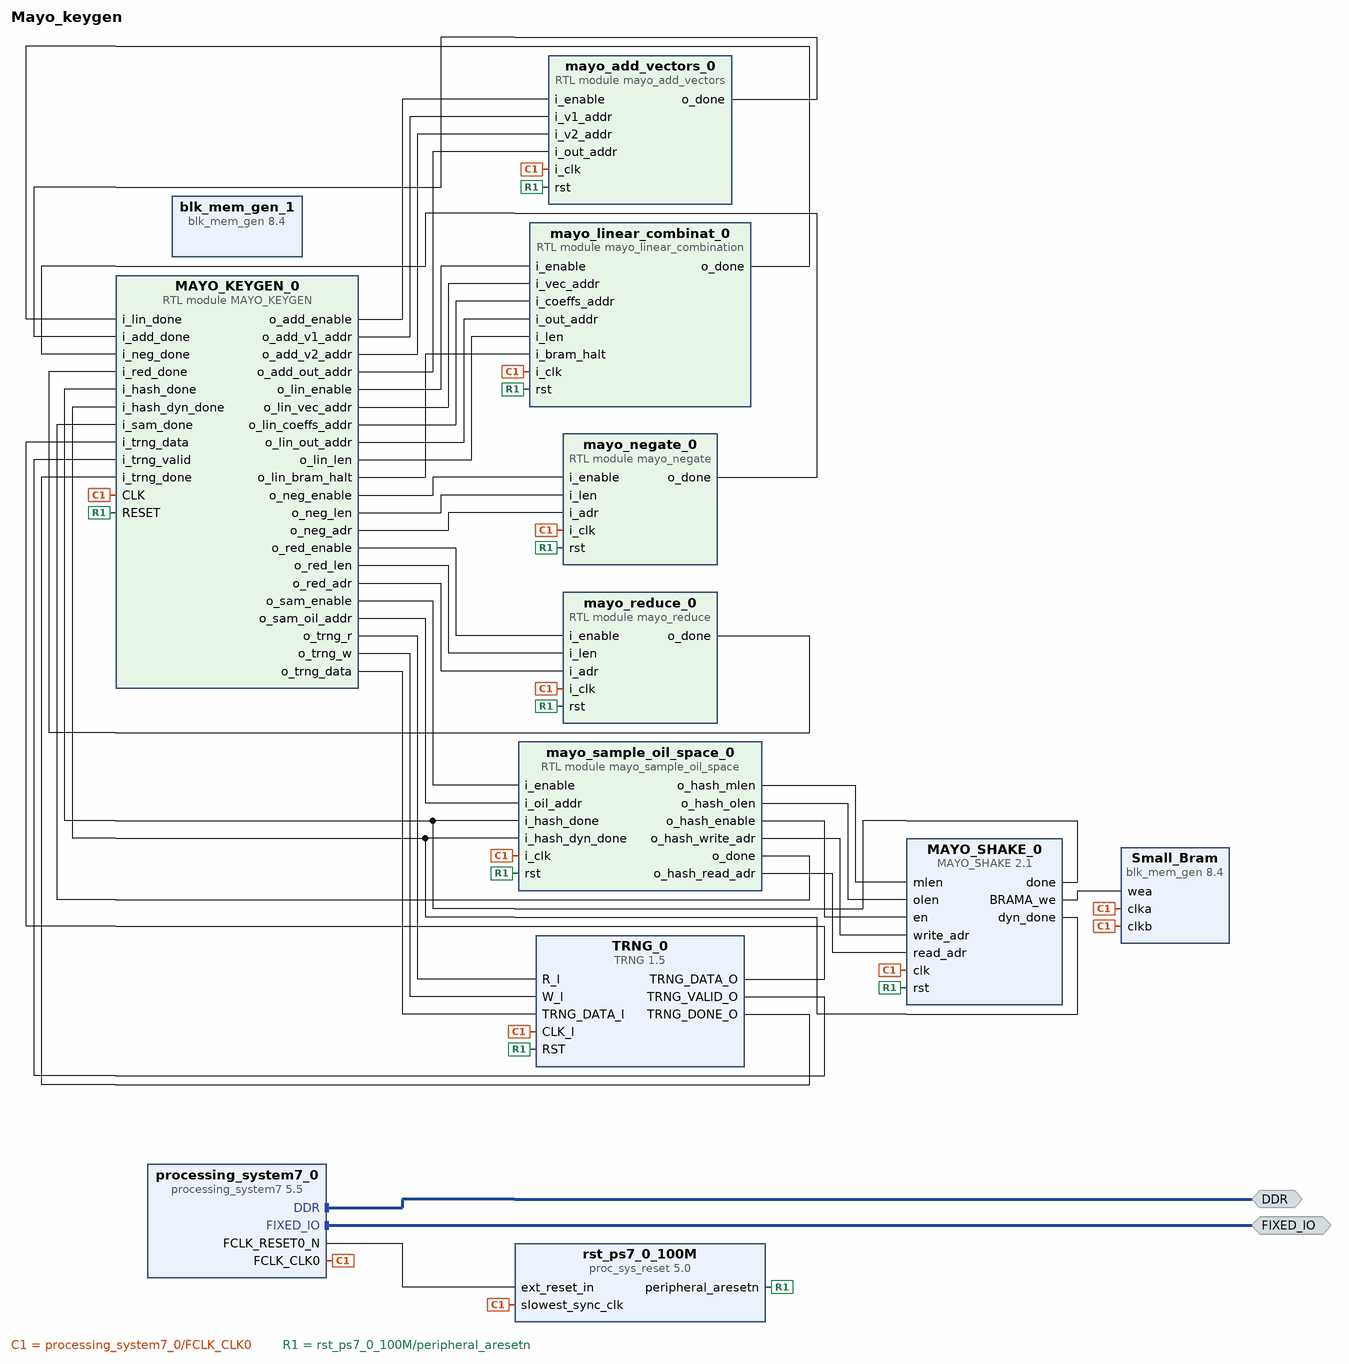
[diagram p0: block diagram of the top level]
# Vivado block design Mayo_keygen, xc7z020clg484-1, Vivado 2020.2
create_bd_design Mayo_keygen

create_bd_intf_port -mode Master -vlnv xilinx.com:interface:ddrx_rtl:1.0 DDR
create_bd_intf_port -mode Master -vlnv xilinx.com:display_processing_system7:fixedio_rtl:1.0 FIXED_IO

create_bd_cell -type ip -vlnv user.org:user:TRNG:1.5 TRNG_0
create_bd_cell -type ip -vlnv xilinx.com:ip:blk_mem_gen:8.4 Small_Bram
set_property -dict [list \
  CONFIG.Byte_Size 8 \
  CONFIG.Enable_32bit_Address false \
  CONFIG.Enable_B Use_ENB_Pin \
  CONFIG.Memory_Type True_Dual_Port_RAM \
  CONFIG.Port_B_Clock 100 \
  CONFIG.Port_B_Enable_Rate 100 \
  CONFIG.Port_B_Write_Rate 50 \
  CONFIG.Read_Width_A 32 \
  CONFIG.Read_Width_B 32 \
  CONFIG.Register_PortA_Output_of_Memory_Primitives false \
  CONFIG.Register_PortB_Output_of_Memory_Primitives false \
  CONFIG.Use_Byte_Write_Enable true \
  CONFIG.Use_RSTA_Pin false \
  CONFIG.Use_RSTB_Pin false \
  CONFIG.Write_Depth_A 16384 \
  CONFIG.Write_Width_A 32 \
  CONFIG.Write_Width_B 32 \
  CONFIG.use_bram_block Stand_Alone \
] [get_bd_cells Small_Bram]
create_bd_cell -type ip -vlnv xilinx.com:ip:blk_mem_gen:8.4 blk_mem_gen_1
set_property -dict [list \
  CONFIG.Enable_32bit_Address false \
  CONFIG.Enable_B Use_ENB_Pin \
  CONFIG.Memory_Type True_Dual_Port_RAM \
  CONFIG.Port_B_Clock 100 \
  CONFIG.Port_B_Enable_Rate 100 \
  CONFIG.Port_B_Write_Rate 50 \
  CONFIG.Register_PortA_Output_of_Memory_Primitives true \
  CONFIG.Register_PortB_Output_of_Memory_Primitives true \
  CONFIG.Use_Byte_Write_Enable false \
  CONFIG.Use_RSTA_Pin false \
  CONFIG.Use_RSTB_Pin false \
  CONFIG.use_bram_block Stand_Alone \
] [get_bd_cells blk_mem_gen_1]
create_bd_cell -type ip -vlnv user.org:user:MAYO_SHAKE:2.1 MAYO_SHAKE_0
create_bd_cell -type ip -vlnv xilinx.com:ip:processing_system7:5.5 processing_system7_0
set_property -dict [list \
  CONFIG.PCW_APU_PERIPHERAL_FREQMHZ 666.666667 \
  CONFIG.PCW_ENET0_ENET0_IO {MIO 16 .. 27} \
  CONFIG.PCW_ENET0_GRP_MDIO_ENABLE 1 \
  CONFIG.PCW_ENET0_GRP_MDIO_IO {MIO 52 .. 53} \
  CONFIG.PCW_ENET0_PERIPHERAL_ENABLE 1 \
  CONFIG.PCW_ENET0_RESET_ENABLE 0 \
  CONFIG.PCW_ENET_RESET_ENABLE 1 \
  CONFIG.PCW_ENET_RESET_SELECT {Share reset pin} \
  CONFIG.PCW_FPGA0_PERIPHERAL_FREQMHZ 100.000000 \
  CONFIG.PCW_FPGA1_PERIPHERAL_FREQMHZ 150.000000 \
  CONFIG.PCW_FPGA2_PERIPHERAL_FREQMHZ 50.000000 \
  CONFIG.PCW_GPIO_MIO_GPIO_ENABLE 1 \
  CONFIG.PCW_GPIO_MIO_GPIO_IO MIO \
  CONFIG.PCW_I2C_RESET_ENABLE 1 \
  CONFIG.PCW_PERIPHERAL_BOARD_PRESET part0 \
  CONFIG.PCW_PRESET_BANK1_VOLTAGE {LVCMOS 1.8V} \
  CONFIG.PCW_QSPI_GRP_SINGLE_SS_ENABLE 1 \
  CONFIG.PCW_QSPI_GRP_SINGLE_SS_IO {MIO 1 .. 6} \
  CONFIG.PCW_QSPI_PERIPHERAL_ENABLE 1 \
  CONFIG.PCW_QSPI_PERIPHERAL_FREQMHZ 200.000000 \
  CONFIG.PCW_QSPI_QSPI_IO {MIO 1 .. 6} \
  CONFIG.PCW_SD0_GRP_CD_ENABLE 1 \
  CONFIG.PCW_SD0_GRP_CD_IO {MIO 47} \
  CONFIG.PCW_SD0_GRP_WP_ENABLE 1 \
  CONFIG.PCW_SD0_GRP_WP_IO {MIO 46} \
  CONFIG.PCW_SD0_PERIPHERAL_ENABLE 1 \
  CONFIG.PCW_SD0_SD0_IO {MIO 40 .. 45} \
  CONFIG.PCW_SDIO_PERIPHERAL_FREQMHZ 50 \
  CONFIG.PCW_SINGLE_QSPI_DATA_MODE x4 \
  CONFIG.PCW_TTC0_PERIPHERAL_ENABLE 1 \
  CONFIG.PCW_TTC0_TTC0_IO EMIO \
  CONFIG.PCW_UART1_PERIPHERAL_ENABLE 1 \
  CONFIG.PCW_UART1_UART1_IO {MIO 48 .. 49} \
  CONFIG.PCW_UART_PERIPHERAL_FREQMHZ 50 \
  CONFIG.PCW_UIPARAM_DDR_FREQ_MHZ 533.333313 \
  CONFIG.PCW_UIPARAM_DDR_PARTNO {MT41J128M16 HA-15E} \
  CONFIG.PCW_USB0_PERIPHERAL_ENABLE 1 \
  CONFIG.PCW_USB0_RESET_ENABLE 0 \
  CONFIG.PCW_USB0_USB0_IO {MIO 28 .. 39} \
  CONFIG.PCW_USB_RESET_ENABLE 1 \
  CONFIG.PCW_USB_RESET_SELECT {Share reset pin} \
  CONFIG.preset ZedBoard \
] [get_bd_cells processing_system7_0]
# 500 more settings of processing_system7_0 are not shown: defaults, MIO pin electricals, DDR timing, and values the tool derives
create_bd_cell -type ip -vlnv xilinx.com:ip:proc_sys_reset:5.0 rst_ps7_0_100M
create_bd_cell -type module -reference MAYO_KEYGEN MAYO_KEYGEN_0
set_property -dict {CONFIG.BRAM_SIZE 13} [get_bd_cells MAYO_KEYGEN_0]
create_bd_cell -type module -reference mayo_add_vectors mayo_add_vectors_0
create_bd_cell -type module -reference mayo_linear_combination mayo_linear_combinat_0
create_bd_cell -type module -reference mayo_sample_oil_space mayo_sample_oil_space_0
create_bd_cell -type module -reference mayo_negate mayo_negate_0
create_bd_cell -type module -reference mayo_reduce mayo_reduce_0

# ---- connections ----

connect_bd_intf_net [get_bd_intf_ports DDR] [get_bd_intf_pins processing_system7_0/DDR]
connect_bd_intf_net [get_bd_intf_ports FIXED_IO] [get_bd_intf_pins processing_system7_0/FIXED_IO]
connect_bd_net [get_bd_pins processing_system7_0/FCLK_CLK0] \
  [get_bd_pins TRNG_0/CLK_I] [get_bd_pins Small_Bram/clka] [get_bd_pins Small_Bram/clkb] [get_bd_pins MAYO_SHAKE_0/clk] \
  [get_bd_pins rst_ps7_0_100M/slowest_sync_clk] [get_bd_pins MAYO_KEYGEN_0/CLK] [get_bd_pins mayo_add_vectors_0/i_clk] \
  [get_bd_pins mayo_linear_combinat_0/i_clk] [get_bd_pins mayo_sample_oil_space_0/i_clk] [get_bd_pins mayo_negate_0/i_clk] \
  [get_bd_pins mayo_reduce_0/i_clk]
connect_bd_net [get_bd_pins processing_system7_0/FCLK_RESET0_N] [get_bd_pins rst_ps7_0_100M/ext_reset_in]
connect_bd_net [get_bd_pins rst_ps7_0_100M/peripheral_aresetn] \
  [get_bd_pins TRNG_0/RST] [get_bd_pins MAYO_SHAKE_0/rst] [get_bd_pins MAYO_KEYGEN_0/RESET] \
  [get_bd_pins mayo_add_vectors_0/rst] [get_bd_pins mayo_linear_combinat_0/rst] [get_bd_pins mayo_sample_oil_space_0/rst] \
  [get_bd_pins mayo_negate_0/rst] [get_bd_pins mayo_reduce_0/rst]
connect_bd_net [get_bd_pins MAYO_KEYGEN_0/o_trng_r] [get_bd_pins TRNG_0/R_I]
connect_bd_net [get_bd_pins MAYO_KEYGEN_0/o_trng_w] [get_bd_pins TRNG_0/W_I]
connect_bd_net [get_bd_pins MAYO_KEYGEN_0/o_trng_data] [get_bd_pins TRNG_0/TRNG_DATA_I]
connect_bd_net [get_bd_pins TRNG_0/TRNG_DATA_O] [get_bd_pins MAYO_KEYGEN_0/i_trng_data]
connect_bd_net [get_bd_pins TRNG_0/TRNG_VALID_O] [get_bd_pins MAYO_KEYGEN_0/i_trng_valid]
connect_bd_net [get_bd_pins TRNG_0/TRNG_DONE_O] [get_bd_pins MAYO_KEYGEN_0/i_trng_done]
connect_bd_net [get_bd_pins MAYO_KEYGEN_0/o_red_enable] [get_bd_pins mayo_reduce_0/i_enable]
connect_bd_net [get_bd_pins MAYO_KEYGEN_0/o_red_len] [get_bd_pins mayo_reduce_0/i_len]
connect_bd_net [get_bd_pins MAYO_KEYGEN_0/o_red_adr] [get_bd_pins mayo_reduce_0/i_adr]
connect_bd_net [get_bd_pins mayo_reduce_0/o_done] [get_bd_pins MAYO_KEYGEN_0/i_red_done]
connect_bd_net [get_bd_pins MAYO_KEYGEN_0/o_lin_enable] [get_bd_pins mayo_linear_combinat_0/i_enable]
connect_bd_net [get_bd_pins MAYO_KEYGEN_0/o_lin_vec_addr] [get_bd_pins mayo_linear_combinat_0/i_vec_addr]
connect_bd_net [get_bd_pins MAYO_KEYGEN_0/o_lin_coeffs_addr] [get_bd_pins mayo_linear_combinat_0/i_coeffs_addr]
connect_bd_net [get_bd_pins MAYO_KEYGEN_0/o_lin_out_addr] [get_bd_pins mayo_linear_combinat_0/i_out_addr]
connect_bd_net [get_bd_pins MAYO_KEYGEN_0/o_lin_len] [get_bd_pins mayo_linear_combinat_0/i_len]
connect_bd_net [get_bd_pins mayo_linear_combinat_0/o_done] [get_bd_pins MAYO_KEYGEN_0/i_lin_done]
connect_bd_net [get_bd_pins MAYO_KEYGEN_0/o_add_enable] [get_bd_pins mayo_add_vectors_0/i_enable]
connect_bd_net [get_bd_pins MAYO_KEYGEN_0/o_add_v1_addr] [get_bd_pins mayo_add_vectors_0/i_v1_addr]
connect_bd_net [get_bd_pins MAYO_KEYGEN_0/o_add_v2_addr] [get_bd_pins mayo_add_vectors_0/i_v2_addr]
connect_bd_net [get_bd_pins MAYO_KEYGEN_0/o_add_out_addr] [get_bd_pins mayo_add_vectors_0/i_out_addr]
connect_bd_net [get_bd_pins mayo_add_vectors_0/o_done] [get_bd_pins MAYO_KEYGEN_0/i_add_done]
connect_bd_net [get_bd_pins MAYO_KEYGEN_0/o_neg_enable] [get_bd_pins mayo_negate_0/i_enable]
connect_bd_net [get_bd_pins MAYO_KEYGEN_0/o_neg_len] [get_bd_pins mayo_negate_0/i_len]
connect_bd_net [get_bd_pins MAYO_KEYGEN_0/o_neg_adr] [get_bd_pins mayo_negate_0/i_adr]
connect_bd_net [get_bd_pins mayo_negate_0/o_done] [get_bd_pins MAYO_KEYGEN_0/i_neg_done]
connect_bd_net [get_bd_pins MAYO_KEYGEN_0/o_lin_bram_halt] [get_bd_pins mayo_linear_combinat_0/i_bram_halt]
connect_bd_net [get_bd_pins MAYO_KEYGEN_0/o_sam_enable] [get_bd_pins mayo_sample_oil_space_0/i_enable]
connect_bd_net [get_bd_pins MAYO_KEYGEN_0/o_sam_oil_addr] [get_bd_pins mayo_sample_oil_space_0/i_oil_addr]
connect_bd_net [get_bd_pins mayo_sample_oil_space_0/o_done] [get_bd_pins MAYO_KEYGEN_0/i_sam_done]
connect_bd_net [get_bd_pins mayo_sample_oil_space_0/o_hash_mlen] [get_bd_pins MAYO_SHAKE_0/mlen]
connect_bd_net [get_bd_pins mayo_sample_oil_space_0/o_hash_olen] [get_bd_pins MAYO_SHAKE_0/olen]
connect_bd_net [get_bd_pins mayo_sample_oil_space_0/o_hash_enable] [get_bd_pins MAYO_SHAKE_0/en]
connect_bd_net [get_bd_pins MAYO_SHAKE_0/done] [get_bd_pins MAYO_KEYGEN_0/i_hash_done] [get_bd_pins mayo_sample_oil_space_0/i_hash_done]
connect_bd_net [get_bd_pins MAYO_SHAKE_0/dyn_done] [get_bd_pins MAYO_KEYGEN_0/i_hash_dyn_done] [get_bd_pins mayo_sample_oil_space_0/i_hash_dyn_done]
connect_bd_net [get_bd_pins mayo_sample_oil_space_0/o_hash_write_adr] [get_bd_pins MAYO_SHAKE_0/write_adr]
connect_bd_net [get_bd_pins mayo_sample_oil_space_0/o_hash_read_adr] [get_bd_pins MAYO_SHAKE_0/read_adr]
connect_bd_net [get_bd_pins MAYO_SHAKE_0/BRAMA_we] [get_bd_pins Small_Bram/wea]

validate_bd_design
save_bd_design
